# EAGLE board eTapper1main53 (EAGLE 8.5.2)
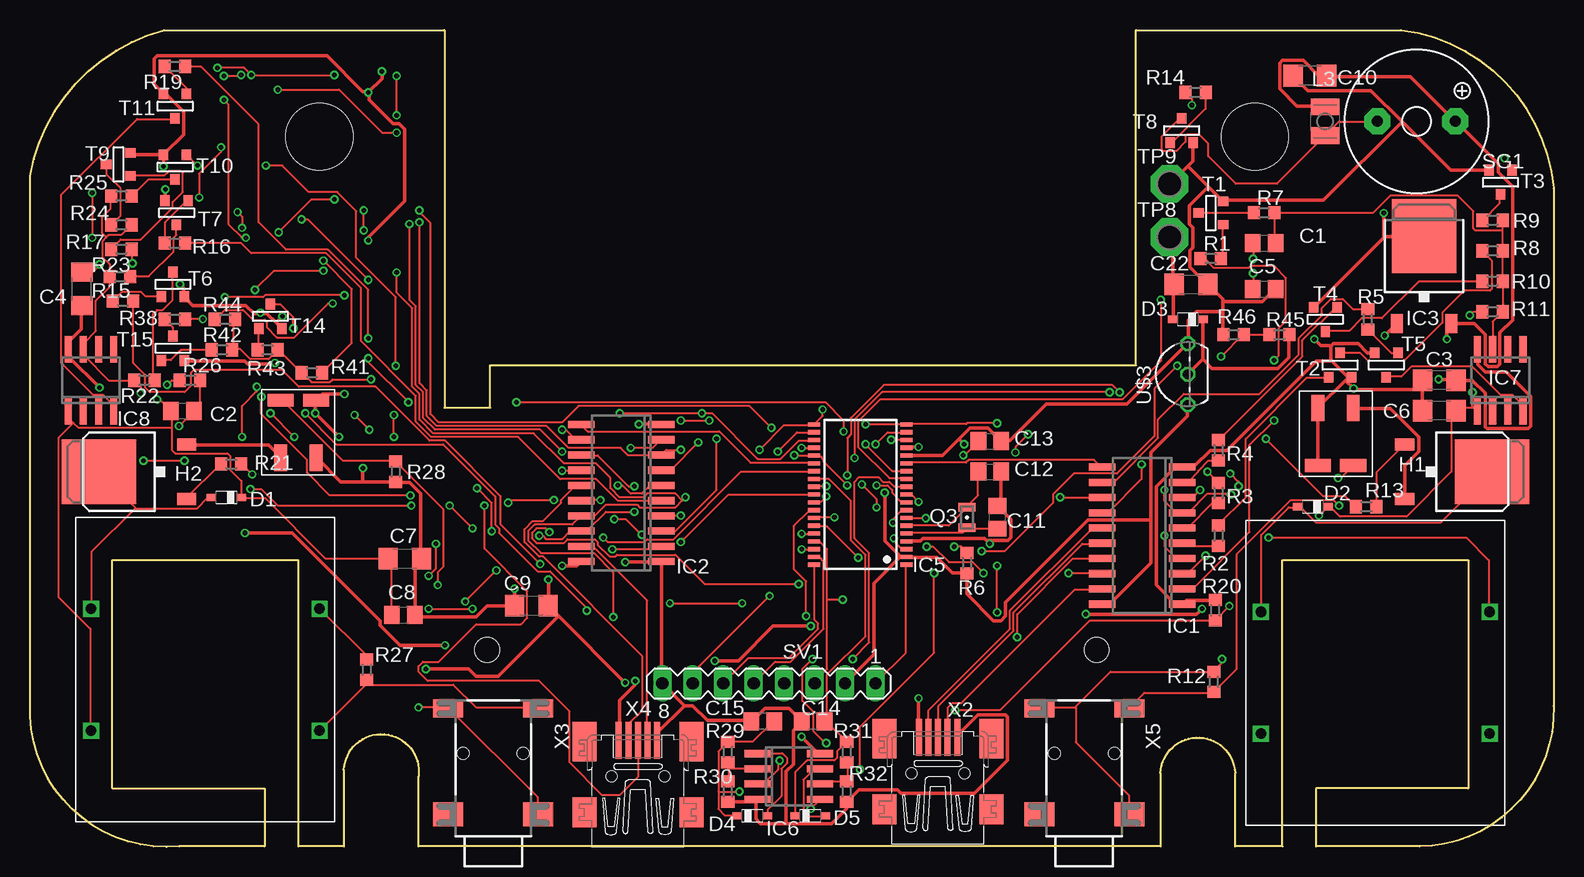
[diagram p1: board, top side]
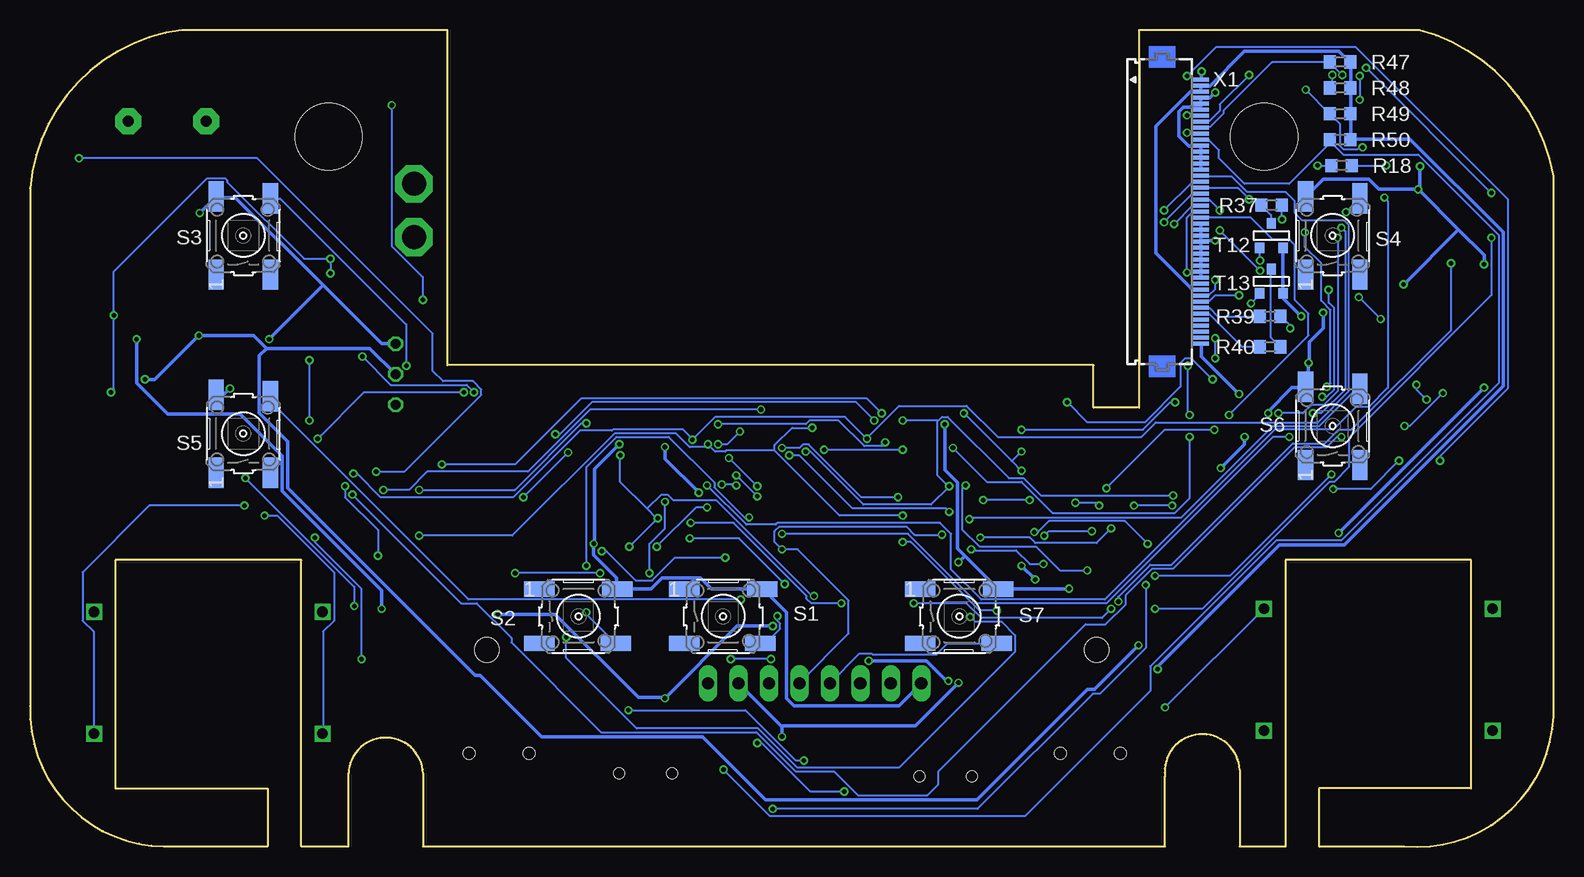
[diagram p2: board, bottom side, seen from below]

Size 127 x 68.12 mm. Coordinates in mm from the lower left corner, seen from the top.
Outline: 104.4,23.93 119.89,23.93 119.89,4.88 107.19,4.88 107.19,0.05 115.83,0.05 arc91 127,11.73 127,54.91 arc78 114.3,68.12 92.21,68.12 92.21,40.18 38.36,40.18 38.36,36.63 34.55,36.63 34.55,68.12 11.18,68.12 arc65 0,55.93 0,11.99 arc98 12.45,0.05 19.56,0.05 19.56,4.88 6.86,4.88 6.86,23.93 22.36,23.93 22.36,0.05 26.17,0.05 26.17,6.4 arc-185 32.39,5.89 32.39,0.05 94.24,0.05 94.24,6.15 arc-175 100.46,6.15 100.46,0.05 104.4,0.05 104.4,23.93
Copper layers (1*16): Top 0.035mm / dielectric 30mil / Bottom 0.035mm
Design rules "default *": minimum track width 6mil, minimum drill 15mil, track to track 6mil, track to pad 6mil, pad to pad 6mil, via to via 6mil, smd to smd 6mil, copper to edge 40mil, drill to drill 6mil, minimum pad ring 6mil, minimum via ring 6mil, stop-mask expansion 4mil, vias tented up to drill 0mil, thermal gap 10mil
Net classes: 1 GND: width 0.305 mm, clearance 0.152 mm; 2 BAT+: width 0.305 mm, clearance 0.152 mm; 3 +9V: width 0.305 mm, clearance 0.152 mm; 4 +3V: width 0.305 mm, clearance 0.152 mm; 5 VCC: width 0.305 mm, clearance 0.152 mm
Holes 5.59 mm at 24.13,59.23 102.11,59.23
Holes 2.03 mm at 38.1,16.43 88.9,16.43

## Footprints (pad centres in the part's own frame; a part is rotated, then mirrored left to right if it is on the bottom)
C0805 = smd 1.3 x 1.5: 1 -0.95,0; 2 0.95,0
C1206 = smd 1.6 x 1.8: 1 -1.4,0; 2 1.4,0
SOD323_ST = smd 0.8 x 0.6: A 1.25,0; C -1.25,0
XFMR = drill 0.889 square: P$1 -10.16,5.08; P$2 -10.16,-5.08; P$3 8.89,5.08; P$4 8.89,-5.08
D-PAK_TO252AA = smd 1 x 1.6: 1 -2.28,-4.8; 3 2.28,-4.8 | smd 5.4 x 6.2: 4 0,2.5
SO20 = smd 0.6 x 2.2: 1 -5.715,-3.33; 2 -4.445,-3.33; 3 -3.175,-3.33; 4 -1.905,-3.33; 5 -0.635,-3.33; 6 0.635,-3.33; 7 1.905,-3.33; 8 3.175,-3.33; 9 4.445,-3.33; 10 5.715,-3.33; 11 5.715,3.33; 12 4.445,3.33; 13 3.175,3.33; 14 1.905,3.33; 15 0.635,3.33; 16 -0.635,3.33; 17 -1.905,3.33; 18 -3.175,3.33; 19 -4.445,3.33; 20 -5.715,3.33
TO252 = smd 1 x 1.6: 1 -2.28,-4.8; 3 2.28,-4.8 | smd 5.4 x 6.2: 2 0,2.5
TSSOP38_R-PDSO-G38-DA = smd 0.35 x 1: 1 -5.85,-3.85; 2 -5.2,-3.85; 3 -4.55,-3.85; 4 -3.9,-3.85; 5 -3.25,-3.85; 6 -2.6,-3.85; 7 -1.95,-3.85; 8 -1.3,-3.85; 9 -0.65,-3.85; 10 0,-3.85; 11 0.65,-3.85; 12 1.3,-3.85; 13 1.95,-3.85; 14 2.6,-3.85; 15 3.25,-3.85; 16 3.9,-3.85; 17 4.55,-3.85; 18 5.2,-3.85; 19 5.85,-3.85; 20 5.85,3.85; 21 5.2,3.85; 22 4.55,3.85; 23 3.9,3.85; 24 3.25,3.85; 25 2.6,3.85; 26 1.95,3.85; 27 1.3,3.85; 28 0.65,3.85; 29 0,3.85; 30 -0.65,3.85; 31 -1.3,3.85; 32 -1.95,3.85; 33 -2.6,3.85; 34 -3.25,3.85; 35 -3.9,3.85; 36 -4.55,3.85; 37 -5.2,3.85; 38 -5.85,3.85
SO8 = smd 0.6 x 2.2: 1 -1.905,-2.6; 2 -0.635,-2.6; 3 0.635,-2.6; 4 1.905,-2.6; 5 1.905,2.6; 6 0.635,2.6; 7 -0.635,2.6; 8 -1.905,2.6
SO08 = smd 0.6 x 2.2: 1 -1.905,-2.6; 2 -0.635,-2.6; 3 0.635,-2.6; 4 1.905,-2.6; 5 1.905,2.6; 6 0.635,2.6; 7 -0.635,2.6; 8 -1.905,2.6
L2825P = smd 1.4 x 2.4: 1 -1.2,0; 2 1.2,0
FC-12M = smd 0.7 x 1.4: 1 -0.85,0; 2 0.85,0
R0603 = smd 1 x 1.1: 1 -0.85,0; 2 0.85,0
B3F-10XX = smd 2.54 x 1.27: 1 -3.251,2.261; 2 3.251,2.261; 3 -3.251,-2.261; 4 3.099,-2.261
F/QMBIII = drill 0.914 pad 2.159 octagon: + 3.251,0; - -3.251,0
MA08-1 = drill 1.016 long: 1 -8.89,0; 2 -6.35,0; 3 -3.81,0; 4 -1.27,0; 5 1.27,0; 6 3.81,0; 7 6.35,0; 8 8.89,0
SOT-23 = smd 0.787 x 0.889: 1 0.025,-1.016; 2 -0.94,1.016; 3 0.991,1.016
P1-20 = drill 2.007 pad 3.15 octagon: TP 0,0
CT02-250 = smd 1.067 x 2.184: P$1 -1.45,-2.4; P$2 1.5,-2.4 | smd 2.184 x 1.067: P$3 1.5,2.4; P$4 -1.45,2.4
TO92- = drill 0.813 octagon: 1 -1.27,1.27; 2 1.27,1.27; 3 3.81,1.27
FH12-45S-0.5SH = smd 0.3 x 1.3: 1 -13,3.25; 2 -12.5,3.25; 3 -12,3.25; 4 -11.5,3.25; 5 -11,3.25; 6 -10.5,3.25; 7 -10,3.25; 8 -9.5,3.25; 9 -9,3.25; 10 -8.5,3.25; 11 -8,3.25; 12 -7.5,3.25; 13 -7,3.25; 14 -6.5,3.25; 15 -6,3.25; 16 -5.5,3.25; 17 -5,3.25; 18 -4.5,3.25; 19 -4,3.25; 20 -3.5,3.25; 21 -3,3.25; 22 -2.5,3.25; 23 -2,3.25; 24 -1.5,3.25; 25 -1,3.25; 26 -0.5,3.25; 27 0,3.25; 28 0.5,3.25; 29 1,3.25; 30 1.5,3.25; 31 2,3.25; 32 2.5,3.25; 33 3,3.25; 34 3.5,3.25; 35 4,3.25; 36 4.5,3.25; 37 5,3.25; 38 5.5,3.25; 39 6,3.25; 40 6.5,3.25; 41 7,3.25; 42 7.5,3.25; 43 8,3.25; 44 8.5,3.25; 45 9,3.25
32005-201 = smd 3.1 x 0.5: 1 3,1.6; 2 3,0.8; 3 3,0; 4 3,-0.8; 5 3,-1.6 | smd 2.5 x 2: M1 -3,-4.45; M2 -3,4.45 | smd 3.3 x 2: M3 2.9,4.45; M4 2.9,-4.45 | hole 0.9: 0,2.2; 0,-2.2
1503_02 = smd 2.5 x 1.5: 1 -3.75,-10.75; 3 3.75,-10.75 | smd 2.5 x 2: 2 -3.75,-1.9; 2@2 3.75,-1.9 | hole 1: -2.5,-7; 2.5,-7

## Placement (x,y rotation side)
C1  .01uF  [C0805]  102.87,50.34 0 top
C2  .01uF  [C0805]  12.7,36.37 0 top
C3  [C1206]  117.48,38.91 180 top
C4  [C1206]  4.32,46.53 90 top
C5  3.3uF  [C0805]  102.87,46.53 0 top
C6  220uF  [C1206]  117.48,36.37 180 top
C7  220uF  [C1206]  31.25,24.05 0 top
C8  3.3uF  [C0805]  31.12,19.35 0 top
C9  47uF  [C1206]  41.79,20.12 180 top
C10  47uF  [C1206]  106.68,64.31 180 top
C11  12pF  [C0805]  80.65,27.48 90 top
C12  12pF  [C0805]  80.01,31.29 0 top
C13  1 uF  [C0805]  80.01,33.83 0 top
C14  0.1uF  [C0805]  65.28,10.46 180 top
C15  0.1uF  [C0805]  61.09,10.46 180 top
C22  220uF  [C1206]  96.78,46.91 0 top
D1  BAT60J  [SOD323_ST]  16.39,29.13 180 top
D2  BAT60J  [SOD323_ST]  106.94,28.37 180 top
D3  BAT60J  [SOD323_ST]  96.52,43.99 180 top
D4  BAT60J  [SOD323_ST]  60.2,2.59 0 top
D5  BAT60J  [SOD323_ST]  65.03,2.59 0 top
DRILEGEND  [DRILEGEND]  -4.57,-8.42 0 top  (outside the outline)
F1  XFMR  [XFMR]  112.78,14.53 0 top
F2  XFMR  [XFMR]  15.24,14.78 0 top
H1  IRLR024N  [D-PAK_TO252AA]  119.38,31.29 270 top
H2  IRLR024N  [D-PAK_TO252AA]  8.26,31.29 90 top
IC1  74AC373  [SO20]  92.71,25.96 90 top
IC2  74AC373  [SO20]  49.28,29.51 90 top
IC3  LM2936DT-5.0  [TO252]  116.21,48.44 0 top
IC5  MSP430F2232IDA  [TSSOP38_R-PDSO-G38-DA]  69.22,29.39 90 top
IC6  AD8620R  [SO8]  63.25,5.89 270 top
IC7  LP2951M  [SO08]  122.56,38.91 0 top
IC8  LP2951M  [SO08]  5.08,38.91 0 top
L3  470uH  [L2825P]  107.95,60.5 270 top
Q3  FC-12M  [FC-12M]  78.11,27.48 90 top
R1  47K  [R0603]  98.43,49.07 0 top
R2  47K  [R0603]  99.06,25.96 90 top
R3  47K  [R0603]  99.06,29.51 90 top
R4  47K  [R0603]  99.06,33.07 90 top
R5  47K  [R0603]  111.51,43.99 270 top
R6  47K  [R0603]  78.11,23.67 270 top
R7  1K  [R0603]  102.87,52.88 0 top
R8  3K  [R0603]  121.92,49.71 0 top
R9  6K  [R0603]  121.92,52.25 0 top
R10  12K  [R0603]  121.92,47.17 0 top
R11  3K  [R0603]  121.92,44.63 0 top
R12  51K  [R0603]  98.68,13.77 270 top
R13  1K  [R0603]  111.38,28.37 0 top
R14  1K  [R0603]  97.16,62.91 0 top
R15  47K  [R0603]  7.75,45.52 180 top
R16  47K  [R0603]  12.07,50.34 180 top
R17  47K  [R0603]  7.62,49.83 180 top
R18  47K  [R0603]  17.66,56.82 0 bottom
R19  47K  [R0603]  12.07,65.07 180 top
R20  47K  [R0603]  98.81,19.73 90 top
R21  1K  [R0603]  16.77,31.93 180 top
R22  1K  [R0603]  9.53,38.91 180 top
R23  3K  [R0603]  7.5,47.55 180 top
R24  6K  [R0603]  7.62,51.87 0 top
R25  12K  [R0603]  7.62,54.28 180 top
R26  3K  [R0603]  13.34,38.91 0 top
R27  51K  [R0603]  28.07,14.78 270 top
R28  47K  [R0603]  30.48,31.29 270 top
R29  50K  [R0603]  58.17,7.92 90 top
R30  1K  [R0603]  58.17,4.62 90 top
R31  50K  [R0603]  68.08,7.92 90 top
R32  1K  [R0603]  68.08,4.62 90 top
R37  100  [R0603]  23.5,53.52 0 bottom
R38  100  [R0603]  12.07,43.99 0 top
R39  100  [R0603]  23.63,44.25 180 bottom
R40  100  [R0603]  23.63,41.71 180 bottom
R41  47K  [R0603]  23.5,39.55 0 top
R42  47K  [R0603]  16.01,41.45 180 top
R43  47K  [R0603]  19.82,41.45 180 top
R44  47K  [R0603]  16.26,43.99 180 top
R45  47K  [R0603]  104.14,42.72 0 top
R46  10K  [R0603]  100.33,42.72 0 top
R47  47K  [R0603]  17.78,65.45 0 bottom
R48  47K  [R0603]  17.78,63.3 0 bottom
R49  47K  [R0603]  17.78,61.14 0 bottom
R50  47K  [R0603]  17.78,58.98 0 bottom
S1  [B3F-10XX]  69.22,19.23 0 bottom
S2  [B3F-10XX]  81.28,19.23 0 bottom
S3  [B3F-10XX]  109.22,50.98 90 bottom
S4  [B3F-10XX]  18.42,50.98 90 bottom
S5  [B3F-10XX]  109.22,34.47 90 bottom
S6  [B3F-10XX]  18.42,35.1 90 bottom
S7  [B3F-10XX]  49.53,19.23 0 bottom
SG1  F/QMBIII  [F/QMBIII]  115.57,60.5 0 top
SV1  100mil  [MA08-1]  61.6,13.64 180 top
T1  2N3904  [SOT-23]  98.43,52.88 270 top
T2  2N3904  [SOT-23]  109.22,40.18 180 top
T3  2N3904  [SOT-23]  122.56,55.42 0 top
T4  2N3904  [SOT-23]  107.95,43.99 0 top
T5  2N3904  [SOT-23]  113.03,40.18 0 top
T6  2N3904  [SOT-23]  11.94,46.91 180 top
T7  2N3904  [SOT-23]  12.2,52.88 0 top
T8  2N3904  [SOT-23]  96.02,59.74 180 top
T9  2N3904  [SOT-23]  7.37,56.95 270 top
T10  2N3904  [SOT-23]  12.07,56.69 0 top
T11  2N3904  [SOT-23]  12.07,61.77 0 top
T12  2N3904  [SOT-23]  23.5,50.98 180 bottom
T13  2N3904  [SOT-23]  23.5,47.17 180 bottom
T14  2N3904  [SOT-23]  20.07,44.25 180 top
T15  2N3904  [SOT-23]  11.94,41.58 180 top
TP8  TPSPAD1-20  [P1-20]  95,50.85 0 top
TP9  TPSPAD1-20  [P1-20]  95,55.29 0 top
U$1  CT02-250  [CT02-250]  108.84,34.21 180 top
U$2  CT02-250  [CT02-250]  22.36,34.85 0 top
U$3  MCP1702  [TO92-]  95.25,40.69 270 top
X1  FH12-45S-0.5SH  [FH12-45S-0.5SH]  32.64,50.98 270 bottom
X2  MINI-USB-SCHIELD-32005-201  [32005-201]  75.7,6.15 90 top
X3  1503_02  [1503_02]  38.61,0.81 180 top
X4  MINI-USB-SCHIELD-32005-201  [32005-201]  50.68,5.89 90 top
X5  1503_02  [1503_02]  87.89,0.81 180 top

## Tracks (layer width: path | path; a pad name or v marks a point on that pad's centre or on a via)
+3V  (via drill 0.38)
  Top 0.305: IC1.20 90,20.24 93.43,23.67 93.43,27.25 | 93.43,27.25 93.43,32.89 96.47,35.94 96.47,36.85 U$3.3 | v74.07,33.35 73.08,33.35 IC5.16 | v71.25,29.54 71.25,25.5 72.55,24.2 | 72.55,24.2 72.93,24.2 IC5.2 73.08,24.13 75.59,24.13 76.89,22.83 78.11,22.83 R6.2 78.11,21.08 80.32,18.87 80.93,18.87 81.31,19.25 81.31,20.39 88.17,27.25 93.43,27.25 | v43.21,22.3 43.21,20.17 C9.1 43.29,20.01 44.05,19.25 | v44.35,23.44 45.57,23.44 45.88,23.75 IC2.20 | v64.32,9.19 65.69,7.82 65.84,7.82 IC6.8 | v49.61,13.69 44.05,19.25 | 72.55,24.2 70.34,22 70.34,16.05 67.97,13.69 SV1.2 | v33,14.83 36.58,14.83 37.19,14.22 39.02,14.22 44.05,19.25
  Bottom 0.305: 29.42,62.99 30.26,62.99 33.15,60.1 33.15,49.5 30.1,46.46 29.42,46.46 X1.36 | 29.42,62.99 X1.3 | 29.42,62.99 29.42,63.45 X1.2 29.27,63.45 28.66,63.45 25.76,66.34 17.91,66.34 17.07,65.51 R47.2 16.92,65.43 16.92,63.37 R48.2 16.92,63.3 16.92,61.24 R49.2 16.92,61.09 16.92,59.03 R50.2 16.77,59.03 11.97,59.03 4.2,51.26 4.2,38.45 17.45,25.2 22.86,25.2 33,15.06 v33,14.83 | v74.07,33.35 74.07,32.36 v71.25,29.54 | v44.35,23.44 v43.21,22.3 | 64.32,10.03 v64.32,9.19 | 64.32,10.03 67.9,13.61 SV1.2 | v49.61,13.69 53.19,10.11 64.24,10.11 64.32,10.03
+9V  (via drill 0.38)
  Top 0.305: IC7.8 120.71,41.5 120.71,40.21 121.31,39.6 123.07,39.6 125.12,37.54 125.12,35.1 124.9,34.87 121.47,34.87 121.31,35.03 121.31,37.84 120.25,38.91 C3.1 118.8,38.99 v117.43,38.99 | C4.1 4.27,45.08 4.27,43.18 3.2,42.11 3.2,41.58 IC8.8 3.28,41.43 3.28,40.82 v5.8,38.3 | 97.77,40.66 97.77,43.94 D3.C | U$3.2 97.77,40.66 | 97.77,40.66 98.53,39.9 104.02,39.9 104.93,40.82 104.93,42.72 R45.2 | v112.93,42.65 IC3.1 | v17.91,26.19 21.87,26.19 29.19,18.87 29.19,18.49 30.87,16.81 v34.6,16.81
  Bottom 0.305: 107.29,41.58 108.36,42.65 v112.93,42.65 116.59,38.99 v117.43,38.99 | 107.29,41.58 98.68,41.58 U$3.2 | v17.91,26.19 v5.8,38.3 | v34.6,16.81 38.26,13.16 38.87,13.16 48.09,3.94 65.69,3.94 70.95,9.19 84.36,9.19 89.46,14.3 89.92,14.3 105.54,29.92 105.54,33.81 107.9,36.17 107.9,40.97 107.29,41.58
/LCS  (via drill 0.38)
  Top 0.152: v71.94,27.02 71.94,27.33 72.62,28.01 73,28.01 IC5.8 | v53.34,20.32 v59.36,20.32 | v33.23,19.86 v36.89,19.86 | v5.19,54.53 v5.19,50.8 | v15.63,64.97 17.84,64.97 v18.44,64.36 v25.38,64.36
  Bottom 0.152: v71.94,27.02 68.36,27.02 62.26,20.93 62.26,20.7 61.88,20.32 v59.36,20.32 | v53.34,20.32 48.92,20.32 47.71,19.1 37.65,19.1 v36.89,19.86 | v33.23,19.86 29.27,19.86 18.67,30.45 18.29,30.45 17.07,31.67 17.07,34.11 5.19,46 v5.19,50.8 | v15.63,64.97 v5.19,54.53 | v18.44,64.36 18.44,63.45 18.6,63.3 R48.1 | v25.38,64.36 27.82,61.92 27.82,61.39 28.66,60.55 29.34,60.55 X1.8
/RST  (via drill 0.38)
  Top 0.152: v74.68,27.41 73.08,27.41 IC5.7 | v77.04,25.04 77.65,25.04 78.11,24.59 R6.1 | v77.8,32.66 77.88,32.66 79.02,33.81 C13.1 | SV1.7 55.25,14.53 v61.65,20.93
  Bottom 0.152: v77.04,25.04 v74.68,27.41 74.76,27.41 75.56,28.21 | v77.8,32.66 77.8,30.45 75.56,28.21 | v61.65,20.93 61.8,20.93 69.8,28.93 73.39,28.93 73.84,29.39 74.38,29.39 75.56,28.21
BAT+
  Top 0.305: D3.A 95.33,44.02 95.33,46.91 C22.1 95.25,46.99 95.25,50.57 95.03,50.8 TP8.TP
GND  (via drill 0.38)
  Top 0.305: R20.2 98.76,20.55 96.4,20.55 96.09,20.24 IC1.1 95.94,20.32 95.41,20.32 93.88,21.84 93.88,30.07 95.48,31.67 IC1.10 96.17,31.75 97.08,31.75 98.38,33.04 99.75,33.04 107.22,40.51 108.36,40.51 108.44,40.59 | C6.2 116.06,36.4 116.06,38.91 C3.2 115.98,38.15 110.42,38.15 v110.34,38.23 109.66,38.91 | 109.66,38.91 107.37,36.63 U$1.P$2 107.37,36.47 107.37,31.82 U$1.P$3 | 109.66,38.91 109.88,39.14 110.11,39.14 T2.2 109.81,39.22 108.44,40.59 | T5.2 111.49,41.2 110.72,41.96 108.67,41.96 108.44,41.73 | 108.44,40.59 108.44,41.73 | T3.2 118.42,56.44 114.38,60.48 | 114.38,60.48 111.79,63.07 106.53,63.07 105.31,64.29 C10.2 | 112.93,50.87 107.07,45.01 T4.2 | 112.93,50.87 116.21,50.87 IC3.2 | v112.86,52.86 112.86,50.95 112.93,50.87 | 96.51,56.78 95.03,55.29 TP9.TP | 96.51,56.78 96.93,57.2 96.93,58.72 T8.2 | 96.51,56.78 98.23,55.07 | 98.23,55.07 99.45,53.85 T1.2 99.52,53.92 107.83,53.92 114.38,60.48 | 77.42,34.03 78.34,34.95 79.86,34.95 80.93,33.88 C13.2 81.08,33.88 81.69,33.88 84.74,36.93 91.44,36.93 96.4,41.88 U$3.1 96.55,41.96 96.55,43.94 97.24,44.63 99.45,44.63 | 77.42,34.03 76.05,32.66 73.08,32.66 IC5.15 | 99.45,45.46 99.45,45.69 98.23,46.91 C22.2 98.07,46.99 96.7,48.36 96.7,49.73 96.93,49.96 96.93,51.64 96.63,51.94 96.63,53.47 98.23,55.07 | 99.45,45.46 99.45,44.63 | 99.45,44.63 99.45,42.72 R46.1 | 99.45,45.46 102.72,45.46 103.79,46.53 C5.2 | v107.07,42.34 107.6,41.81 108.36,41.81 108.44,41.73 | v26.22,37.77 24.39,37.77 23.93,37.31 U$2.P$3 23.78,37.16 v23.78,36.17 v25.76,34.19 | v20.43,40.36 20.35,40.28 18.14,40.28 17.91,40.51 12.88,40.51 T15.2 | 20.5,43.71 19.74,44.47 19.21,44.47
  Top 0.305: 20.5,43.71 20.96,43.25 T14.2 | 19.21,44.47 18.67,44.47 17.99,45.16 13.57,45.16 12.88,45.85 T6.2 12.81,46 12.81,46.61 v12.5,46.91 | 20.5,43.71 v21.04,44.25 | v19.21,44.55 19.21,44.47 | v29.34,64.67 29.34,64.06 v28.2,62.91 | v28.2,50.57 28.2,50.8 31.25,53.85 31.25,59.87 30.79,60.32 30.26,60.32 28.27,62.3 28.27,62.84 v28.2,62.91 | T9.2 8.54,57.73 11.13,57.73 T10.2 | T10.2 11.21,57.81 12.81,59.41 12.81,61.31 11.36,62.76 11.13,62.76 T11.2 11.05,62.91 10.37,63.6 10.37,65.73 10.6,65.96 24.77,65.96 27.74,62.99 28.12,62.99 v28.2,62.91 | v11.28,54.84 11.28,53.92 T7.2 | v5.8,48.59 5.19,47.98 4.35,47.98 C4.2 | v11.13,56.74 T10.2 | 27.74,30.45 25.91,30.45 23.93,32.43 U$2.P$2 | 27.74,30.45 30.48,30.45 R28.2 30.56,30.38 31.63,30.38 32.54,29.46 32.54,24.13 C7.2 32.62,24.05 32.08,23.52 32.08,19.4 C8.2 32.16,19.25 32.24,19.18 37.19,19.18 38.1,20.09 40.31,20.09 C9.2 40.39,20.24 v40.39,21.54 | R30.1 58.22,3.78 60.43,3.78 60.58,3.94 IC6.4 60.51,3.71 60.51,2.34 60.89,1.95 63.02,1.95 | 63.02,1.95 66.83,1.95 68.05,3.17 68.05,3.71 R32.1 68.2,3.86 69.12,4.77 72.32,4.77 72.62,4.47 78.72,4.47 81.46,7.21 81.46,10.87 81.31,11.02 79.02,11.02 77.35,9.35 77.35,9.19 X2.5 | 80.01,25.58 81.54,25.58 81.77,25.81 81.77,27.33 80.7,28.4 C11.2 80.7,28.55 80.93,28.78 80.93,31.29 C12.2 | 80.01,25.58 79.71,25.58 79.56,25.73 74.45,25.73 74.22,25.5 73.08,25.5 IC5.4 | v80.01,25.27 80.01,25.58 | v50.75,35.25 52.58,35.25 IC2.10 | 54.56,11.78 55.25,11.78 56.47,10.57 60.05,10.57 C15.2 60.2,10.49 61.27,11.56 63.25,11.56 64.32,10.49 C14.2 64.24,10.34 63.63,9.73 63.63,6.91 63.02,6.3 63.02,1.95
  Top 0.305: 54.56,11.78 SV1.8 52.66,13.69 52.66,23.75 IC2.1 52.51,23.75 v49.61,23.75 | 54.56,11.78 52.28,9.5 52.28,8.96 X4.5 | 27.74,30.45 v27.74,31.6 | v77.88,33.58 77.42,34.03
  Bottom 0.305: v110.34,38.23 110.8,37.77 111.49,37.77 S5.2 | v112.86,52.86 S3.2 111.41,54.15 109.88,54.15 102.57,46.84 | 102.57,46.84 97.69,41.96 U$3.1 | 102.57,46.84 v107.07,42.34 | v26.22,37.77 29.34,40.89 29.34,41.96 X1.45 | T12.2 T13.2 22.48,46.07 22.48,45.69 v21.04,44.25 | v19.21,44.55 19.21,43.25 20.35,42.11 20.35,40.44 v20.43,40.36 20.43,38.61 S6.2 20.81,38.3 21.8,38.3 23.78,36.32 v23.78,36.17 | X1.34 29.42,47.52 29.42,47.9 X1.33 29.42,48.13 29.42,48.44 X1.32 29.42,48.59 29.42,48.97 X1.31 29.42,49.12 29.42,49.43 X1.30 29.42,49.58 29.42,49.96 X1.29 29.42,50.11 29.42,50.42 X1.28 | X1.28 29.42,50.57 29.42,50.95 X1.27 29.42,51.1 29.42,51.41 X1.26 29.42,51.56 29.42,51.94 X1.25 | X1.16 29.42,56.51 29.42,56.97 X1.15 29.42,57.12 29.42,57.43 X1.14 29.42,57.58 29.42,57.96 X1.13 29.42,58.11 29.42,58.42 X1.12 29.57,58.42 30.41,58.42 31.25,59.26 31.25,61.31 30.87,61.7 29.42,61.7 | 29.42,61.7 29.42,61.92 X1.5 29.42,62.08 29.42,62.46 X1.4 29.27,62.46 28.66,62.46 v28.2,62.91 | 29.42,61.7 29.42,61.54 X1.6 | v29.34,64.67 29.34,63.98 X1.1 | v28.2,50.57 29.27,50.57 X1.28 | v11.28,54.84 14.56,54.84 15.4,55.68 19.21,55.68 20.65,54.23 S4.2 | v5.8,48.59 5.8,49.35 7.93,51.48 | v11.28,54.84 7.93,51.48 | v11.13,56.74 11.13,54.84 v11.28,54.84 | 7.93,51.48 v12.5,46.91 | v50.75,35.25 50.75,31.44 49.69,30.38 49.69,24.89 49.08,24.28 | 49.08,24.28 S7.2 46.18,21.54 v40.39,21.54 | v49.61,23.75 49.08,24.28 | SV1.8 54.56,11.78 63.33,11.78 63.94,12.39 63.94,19.56 65.84,21.46 S1.2 65.99,21.54 70.18,21.54 71.1,22.45 74.3,22.45 75.21,21.54 78.03,21.54 S2.2 78.11,21.61 78.11,22.45 80.01,24.36 v80.01,25.27 79.94,25.35 79.94,31.52 v77.88,33.58
  Bottom 0.305: v25.76,34.19 25.76,33.58 v27.74,31.6
IO1_0  (via drill 0.38)
  Top 0.152: v64.7,19.25 64.7,22.15 63.71,23.14 63.71,26.8 64.93,28.01 65.31,28.01 IC5.31
  Bottom 0.152: v64.7,19.25 64.7,18.87 64.47,18.64 64.47,18.19 65.69,16.97 S1.4
IO1_1  (via drill 0.38)
  Top 0.152: v67.06,27.48 65.38,27.48 IC5.32 | v80.62,19.56 v80.62,23.44
  Bottom 0.152: v67.06,27.48 67.44,27.48 69.96,30 69.96,30.38 73.77,34.19 78.11,34.19 80.62,31.67 v80.62,23.44 | v80.62,19.56 80.62,19.4 S2.4
IO1_2  (via drill 0.38)
  Top 0.152: v69.04,24.13 66.45,26.72 65.38,26.72 IC5.33 | v79.33,24.66 81.23,24.66 85.27,28.7 85.27,29.39 87.02,31.14 90.61,31.14 93.73,34.26 93.73,38.23 v95.64,40.13
  Bottom 0.152: v69.04,24.13 73.23,24.13 75.14,22.22 76.51,22.22 78.95,24.66 v79.33,24.66 | v95.64,40.13 95.64,43.56 106.15,54.08 S3.4
IO1_3  (via drill 0.38)
  Top 0.152: v64.32,26.11 65.31,26.11 IC5.34 | v20.05,36.17 v22.03,34.19 | v17.68,51.64 17.68,52.55 v17.3,52.93
  Bottom 0.152: v64.32,26.11 53.8,26.11 48.01,20.32 37.27,20.32 23.4,34.19 v22.03,34.19 | v20.05,36.17 19.36,36.17 17.38,38.15 17.38,51.33 v17.68,51.64 | S4.4 v17.3,52.93
IO4_0  (via drill 0.38)
  Top 0.152: v71.78,33.96 73,33.96 IC5.17 | v57.23,34.03 57.23,29.77 53.8,26.34 IC2.3 | v98,24.28 96.55,22.83 96.09,22.83 IC1.3 | v100.74,30.07 100.74,30.45 v100.06,31.14
  Bottom 0.152: X1.17 29.34,55.9 26.83,55.9 25.53,54.61 22.33,54.61 21.57,53.85 21.57,52.86 20.96,52.25 17.45,52.25 17.07,51.87 17.07,38 19.66,35.41 33.15,35.41 34.37,34.19 46.33,34.19 48.92,36.78 54.56,36.78 57.23,34.11 v57.23,34.03 59.06,35.86 69.88,35.86 v71.78,33.96 71.78,34.03 72.55,34.8 78.41,34.8 78.49,34.72 81.16,34.72 86.72,29.16 97.77,29.16 99.75,31.14 v100.06,31.14 | v98,24.28 98,26.41 100.74,29.16 v100.74,30.07
IO4_1  (via drill 0.38)
  Top 0.152: v70.49,33.58 71.48,34.57 73,34.57 IC5.18 | v54.26,27.63 52.66,27.63 IC2.4 | v32.47,53.08 32.47,52.93 33.38,52.02 33.38,36.09 34.07,35.41 44.35,35.41 45.72,36.78 59.97,36.78 v61.8,34.95 | IC1.4 95.56,24.05 94.57,25.04 v94.57,25.96
  Bottom 0.152: 64.93,33.04 68.97,33.04 69.04,32.97 69.88,32.97 v70.49,33.58 70.49,33.5 70.64,33.35 72.01,33.35 73.16,34.49 78.26,34.49 86.8,25.96 v94.57,25.96 | 64.93,33.04 59.52,27.63 v54.26,27.63 | v32.47,53.08 30.1,55.45 29.42,55.45 X1.18 | v61.8,34.95 63.48,34.95 64.93,33.5 64.93,33.04
IO4_2  (via drill 0.38)
  Top 0.152: v69.65,35.25 73,35.25 IC5.19 73.08,35.25 78.03,35.25 78.11,35.33 v80.62,35.33 | v55.71,33.73 53.42,31.44 52.66,31.44 IC2.7 | v25.38,54 23.47,54 v20.73,51.26 | v18.9,38.38 18.9,38 17.68,36.78 v17.68,34.19 | v100.13,29.39 99.75,29.39 99.67,29.46 98.15,29.46 96.55,27.86 IC1.7 95.56,27.86 94.57,28.85 v94.57,29.77
  Bottom 0.152: v69.65,35.25 62.34,35.25 62.03,35.56 59.59,35.56 57.46,33.43 56.01,33.43 v55.71,33.73 | v25.38,54 26.29,54.91 29.34,54.91 X1.19 | v20.73,51.26 20.73,50.04 19.36,48.67 19.36,45.54 18.6,44.78 18.6,38.68 v18.9,38.38 | v17.68,34.19 18.06,34.19 18.9,33.35 21.57,33.35 31.7,23.21 33.46,23.21 35.67,21 35.67,20.24 37.34,18.57 39.02,18.57 51.29,6.3 51.29,5.23 52.2,4.32 57.99,4.32 59.97,6.3 63.17,6.3 66.45,9.57 79.4,9.57 86.87,17.04 86.87,17.42 89.77,20.32 91.06,20.32 v100.13,29.39 | v80.62,35.33 81.01,35.33 86.57,29.77 v94.57,29.77
IO4_3  (via drill 0.38)
  Top 0.152: v60.81,33.12 62.87,35.18 65.31,35.18 IC5.20 65.38,35.25 66.07,35.94 v66.07,36.47 | v54.26,33.12 53.04,33.12 52.66,32.74 IC2.8 52.58,32.66 49.84,32.66 49.23,33.27 44.89,33.27 43.06,35.1 33.91,35.1 33.08,35.94 33.08,38.07 32.47,38.68 v32.47,52.09 | v97.54,29.77 96.93,29.16 96.09,29.16 IC1.8
  Bottom 0.152: v54.26,33.12 v60.81,33.12 | v32.47,52.09 30.1,54.46 29.42,54.46 X1.20 | v97.54,29.77 95.41,29.77 93.88,31.29 85.5,31.29 80.32,36.47 v66.07,36.47
IO4_4  (via drill 0.38)
  Top 0.152: v62.34,32.97 63.94,34.57 65.31,34.57 IC5.21 | v50.37,30.07 49.92,30.07 47.32,32.66 45.95,32.66 IC2.13 | v27.82,51.41 v27.82,53.08 | v24.46,48.06 20.35,48.06 v18.75,46.46 | v19.28,37.54 19.28,36.09 23.09,32.28 23.09,31.22 25,29.31 v31.7,29.31 | v85.88,29.16 89.31,29.16 IC1.13 | v82.15,32.89 82.15,33.35 v83.21,34.42 | v54.26,35.56 v56.62,35.56
  Bottom 0.152: v62.34,32.97 61.96,32.97 57.54,28.55 51.9,28.55 v50.37,30.07 50.45,30.07 51.36,30.99 51.36,35.48 51.33,35.52 | v27.82,53.08 28.66,53.92 29.34,53.92 X1.21 | v24.46,48.06 v27.82,51.41 | v18.75,46.46 18.75,45.39 18.29,44.93 18.29,38.15 18.9,37.54 v19.28,37.54 | v31.7,29.31 42.75,29.31 44.2,30.76 45.42,30.76 50.53,35.86 50.98,35.86 51.33,35.52 | v82.15,32.89 v85.88,29.16 | v83.21,34.42 82.83,34.42 80.17,37.08 58.15,37.08 v56.62,35.56 | v54.26,35.56 51.36,35.56 51.33,35.52
IO4_5  (via drill 0.38)
  Top 0.152: v49.15,36.17 v56.01,36.17 56.85,36.17 60.66,32.36 62.56,32.36 64.09,33.88 65.31,33.88 IC5.22 | v44.35,31.37 45.88,31.37 IC2.14 | v31.63,51.94 31.63,45.62 32.16,45.08 32.16,38.53 32.77,37.92 32.77,35.79 33.76,34.8 42.52,34.8 v44.35,32.97 | IC1.14 89.84,27.86 92.66,30.68 v92.66,31.9
  Bottom 0.152: v44.35,31.37 45.15,32.17 | 45.15,32.17 v49.15,36.17 | v31.63,51.94 30.1,53.47 29.42,53.47 X1.22 | 45.15,32.17 v44.35,32.97 | v92.66,31.9 86.57,31.9 81.08,37.39 57.23,37.39 v56.01,36.17
IO4_6  (via drill 0.38)
  Top 0.152: v64.32,33.27 65.31,33.27 IC5.23 | 54.37,28.89 53.8,28.32 50.83,28.32 50.6,28.55 48.01,28.55 47.1,27.63 45.95,27.63 IC2.17 45.88,27.56 45.19,26.87 42.07,26.87 41.53,26.34 41.53,25.58 42.6,24.51 47.02,24.51 48.62,22.91 v48.62,19.18 | 54.37,28.89 v54.64,29.16 | v30.56,47.9 30.56,46.23 31.86,44.93 31.86,38.38 32.47,37.77 32.47,35.63 33.61,34.49 41.99,34.49 44.51,31.98 47.17,31.98 48.39,30.76 48.39,29.92 49.15,29.16 51.13,29.16 51.44,29.46 53.8,29.46 54.37,28.89 | IC1.17 86.95,24.05 82.3,19.4 v82.3,17.5
  Bottom 0.152: v64.32,33.27 62.87,33.27 62.56,33.58 62.11,33.58 57.69,29.16 v54.64,29.16 | v30.56,47.9 30.56,52.48 30.1,52.93 29.42,52.93 X1.23 | v82.3,17.5 82.3,15.75 76.43,9.88 66.3,9.88 63.02,6.6 54.56,6.6 44.89,16.28 44.89,17.65 46.03,18.79 48.24,18.79 v48.62,19.18
IO4_7  (via drill 0.38)
  Top 0.152: v63.71,32.66 65.31,32.66 IC5.24 65.38,32.59 65.84,32.59 66.15,32.28 66.15,32.13 v68.13,30.15 | v50.37,27.94 48.01,27.94 46.41,26.34 IC2.18 45.04,26.34 44.35,25.65 43.06,25.65 42.75,25.96 v42.45,25.96 | v28.27,34.8 v27.06,36.02 | v37.27,29.92 38.49,28.7 v38.49,26.34 | v86.57,22.83 89.31,22.83 IC1.18 | v79.48,22.83 78.57,23.75 76.59,23.75 75.29,25.04 v74.76,25.04 | v70.57,28.32 70.57,29.01 v69.35,30.22
  Bottom 0.152: v63.71,32.66 62.87,32.66 58.45,28.24 50.68,28.24 v50.37,27.94 | v27.06,36.02 20.43,42.65 20.43,44.47 21.57,45.62 21.57,50.19 22.03,50.65 23.4,50.65 25.23,52.48 29.34,52.48 X1.24 | v28.27,34.8 32.39,34.8 v37.27,29.92 | v38.49,26.34 42.07,26.34 v42.45,25.96 | v79.48,22.83 v86.57,22.83 | v74.76,25.04 71.48,28.32 v70.57,28.32 | v69.35,30.22 68.2,30.22 v68.13,30.15
LADC  (via drill 0.38)
  Top 0.152: 57.38,4.62 57.38,7.97 58.15,8.74 R29.2 58.22,8.81 60.28,8.81 61.88,10.41 62.03,10.41 C15.1 | 57.38,4.62 57.38,3.17 57.92,2.64 58.91,2.64 D4.C | v68.58,15.67 69.96,17.04 69.96,24.51 68.74,25.73 68.74,30.45 69.12,30.83 70.72,30.83 71.1,30.45 71.63,30.45 72.01,30.07 73,30.07 IC5.11 | v65.23,15.67 64.39,14.83 64.39,12.17 65.31,11.25 65.31,9.65 66.3,8.66 v66.37,8.66 | 57.38,4.62 v59.14,4.62
  Bottom 0.152: v65.23,15.67 v68.58,15.67 | v66.37,8.66 65.99,8.66 61.96,4.62 v59.14,4.62
LCLOCK
  Top 0.152: IC1.16 89.31,25.27 87.71,25.27 82,19.56 82,18.03 75.75,11.78 75.75,9.19 X2.3
LCLR
  Top 0.152: IC1.19 89.31,21.46 87.1,21.46 77.65,12.01 76.89,12.01 76.51,11.63 76.51,9.19 X2.4
LD_/C  (via drill 0.38)
  Top 0.152: IC5.29 58.22,29.39 v54.26,25.42 | v46.41,19.71 46.41,19.94 43.36,22.99 42.3,22.99 39.1,26.19 39.1,26.57 38.79,26.87 38.79,29.23 34.45,33.58 25.53,33.58 v22.94,36.17 | v17.99,50.8 17.68,50.8 16.54,51.94 16.54,61.92 v16.16,62.3 | v16.16,64.29 17.53,64.29 v17.61,64.36
  Bottom 0.152: v54.26,25.42 53.57,25.42 47.86,19.71 v46.41,19.71 | v22.94,36.17 20.88,36.17 20.2,36.85 19.13,36.85 17.99,38 v17.99,50.8 | v16.16,64.29 v16.16,62.3 | v17.61,64.36 18.67,65.43 R47.1 18.75,65.43 23.47,65.43 27.51,61.39 27.51,61.16 28.66,60.02 29.34,60.02 X1.9
LDIN
  Top 0.152: IC1.15 89.31,26.57 88.55,26.57 81.69,19.71 81.69,18.19 74.91,11.4 74.91,9.19 X2.2
LEDK1  (via drill 0.38)
  Top 0.152: v22.64,52.32 23.17,52.32 v28.2,47.29
  Bottom 0.152: v22.64,52.32 22.64,53.47 R37.2 | v28.2,47.29 28.2,46.53 28.73,46 29.34,46 X1.37
LEDK2  (via drill 0.38)
  Top 0.152: v14.41,44.02 12.96,44.02 R38.2 | v16.24,45.85 19.44,45.85 19.59,46 v26.22,46
  Bottom 0.152: v16.24,45.85 v14.41,44.02 | v26.22,46 28.2,46 28.66,45.54 29.34,45.54 X1.38
LEDK3
  Bottom 0.152: R39.2 27.97,44.25 28.66,44.93 29.34,44.93 X1.39
LEDK4
  Bottom 0.152: R40.2 24.54,41.73 25.99,41.73 28.73,44.47 29.34,44.47 X1.40
LHVTRIG  (via drill 0.38)
  Top 0.152: v66.37,29.23 65.92,28.78 65.38,28.78 IC5.30 | v68.13,30.99 68.13,34.11 68.43,34.42 68.43,35.79 71.18,38.53 90.23,38.53 v90.83,37.92 | v103.03,34.03 107.83,29.23 109.66,29.23 110.49,28.4 R13.1
  Bottom 0.152: v68.13,30.99 v66.37,29.23 | v90.83,37.92 99.14,37.92 v103.03,34.03
LLED  (via drill 0.38)
  Top 0.152: R44.1 17.07,43.94 16.92,43.79 16.92,41.5 R42.1 17,41.5 17.53,41.5 18.37,40.66 19.89,40.66 20.65,41.43 R43.1 20.73,41.43 22.64,39.52 R41.1 22.71,39.52 23.47,38.76 25,38.76 25.23,38.99 v28.43,38.99 | v69.65,33.58 71.86,31.37 73,31.37 IC5.13 | v67.82,34.64 67.82,35.56 66.3,37.08 v40.54,37.08
  Bottom 0.152: v69.65,33.58 68.89,33.58 v67.82,34.64 | v40.54,37.08 38.87,35.41 34.07,35.41 31.09,38.38 31.09,40.36 30.71,40.74 30.18,40.74 v28.43,38.99
LOPA  (via drill 0.38)
  Top 0.152: v99.98,20.09 98.84,18.95 R20.1 98.76,18.87 88.32,18.87 80.85,11.4 v77.12,11.4 | v109.05,30.76 109.28,30.76 110.27,31.75 U$1.P$4 | v62.49,7.21 62.34,7.06 62.34,6.45 61.19,5.31 60.66,5.31 IC6.3
  Bottom 0.152: v99.98,20.09 99.98,21.69 v109.05,30.76 | v62.49,7.21 63.17,7.21 67.37,11.4 v77.12,11.4
LRD  (via drill 0.38)
  Top 0.152: IC5.10 73.46,29.39 v74.07,28.78 | v75.37,22.83 75.37,16.2 69.19,10.03 v69.19,6.45
  Bottom 0.152: v74.07,28.78 74.07,26.57 75.37,25.27 v75.37,22.83 | v69.19,6.45 65.31,2.56 44.05,2.56 33.61,13 33.61,15.06 23.09,25.58 17.68,25.58 4.58,38.68 4.58,51.03 11.28,57.73 17.53,57.73 18.6,58.8 18.6,58.95 R50.1 18.6,58.72 22.03,55.29 25.76,55.29 27.89,57.43 27.89,58.11 28.73,58.95 29.34,58.95 X1.11
LRESET  (via drill 0.38)
  Top 0.152: v47.78,25.81 48.16,25.42 51.21,25.42 51.44,25.65 53.65,25.65 59.29,31.29 65.31,31.29 IC5.26 | v34.98,28.47 v36.89,26.57 | v31.78,28.47 20.65,28.47 19.28,29.84 v18.37,29.84 | v9.45,32.21 v12.88,32.21 | v30.56,61.01 v30.56,64.29
  Bottom 0.152: v47.78,25.81 43.67,25.81 43.21,25.35 38.1,25.35 v36.89,26.57 | v31.78,28.47 v34.98,28.47 | v18.37,29.84 15.24,29.84 v12.88,32.21 | v9.45,32.21 9.45,32.59 3.81,38.23 3.81,54 16.54,66.72 28.12,66.72 v30.56,64.29 | v30.56,61.01 29.42,61.01 X1.7
LTS+  (via drill 0.38)
  Top 0.152: X5.1 91.67,11.63 92.89,12.85 98.68,12.85 R12.2 100.59,14.83 100.59,24.43 105.08,28.93 108.67,28.93 v109.12,28.47
  Bottom 0.152: v109.12,28.47 117.05,28.47 122.61,22.91 122.61,18.87 121.7,17.96 121.7,9.5 F1.P$4
LTS-  (via drill 0.38)
  Top 0.152: 87.14,11.67 87.1,11.63 84.21,11.63 X5.3 | 87.14,11.67 90.07,14.6 98.68,14.6 R12.1 98.68,14.68 99.37,15.37 v99.37,15.67 | X5.2 91.6,2.72 91.6,4.32 87.18,8.74 87.18,11.63 87.14,11.67 | v103.26,25.81 119.71,25.81 121.62,23.9 121.62,19.63 F1.P$3
  Bottom 0.152: v103.26,25.81 103.26,25.42 99.37,21.54 v99.37,15.67
LVSEL
  Top 0.152: IC5.14 73.08,32.05 78.03,32.05 78.26,32.28 88.7,32.28 89.31,31.67 IC1.11
LWR  (via drill 0.38)
  Top 0.152: v70.57,30.15 71.48,30.15 71.86,29.77 71.86,29.54 72.62,28.78 73,28.78 IC5.9 | v14.1,54.15 14.1,56.13 15.93,57.96 v15.93,58.34 | v30.56,59.56 29.34,59.56 25.76,63.14 v20.65,63.14
  Bottom 0.152: v70.57,30.15 67.29,26.87 64.85,26.87 64.7,27.02 51.13,27.02 50.22,26.11 50.22,23.14 47.71,20.62 37.42,20.62 23.25,34.8 18.37,34.8 16.46,36.7 15.4,36.7 13.8,38.3 13.8,53.85 v14.1,54.15 | v15.93,58.34 16.16,58.34 16.31,58.19 17.53,58.19 17.84,58.49 17.84,60.32 18.6,61.09 R49.1 18.67,61.16 v20.65,63.14 | v30.56,59.56 30.48,59.49 29.42,59.49 X1.10
N$1  (via drill 0.38)
  Top 0.152: v103.71,40.59 104.09,40.97 104.09,43.25 104.7,43.86 104.7,47.45 103.71,48.44 101.73,48.44 101.58,48.28 98.68,48.28 97.92,49.05 97.62,49.05 R1.1 | v103.71,35.56 101.66,33.5 101.66,26.26 96.93,21.54 96.09,21.54 IC1.2
  Bottom 0.152: v103.71,35.56 v103.71,40.59
N$2
  Top 0.152: R2.1 96.25,25.12 96.09,25.27 IC1.5
N$3
  Top 0.152: R3.1 99.06,28.62 98.53,28.62 96.55,26.64 96.09,26.64 IC1.6
N$4
  Top 0.152: R4.1 99.06,32.21 98.23,32.21 97.39,31.37 97.39,31.29 96.55,30.45 96.09,30.45 IC1.9
N$5
  Top 0.152: R5.1 111.49,44.86 110.27,44.86 109.43,45.69 108.44,45.69 107.68,44.93 107.68,44.32 105.77,42.42 105.77,41.05 102.49,37.77 96.17,37.77 94.04,35.63 94.04,34.11 90.38,30.45 89.39,30.45 IC1.12
N$6
  Top 0.152: T8.1 95.94,60.7 95.79,60.7 94.34,59.26 94.34,58.19 94.49,58.04 95.56,58.04 96.32,58.8 96.32,59.26 96.47,59.41 97.46,59.41 98.23,58.65 98.23,57.58 100.51,55.29 103.94,55.29 107.9,59.26 L3.2 107.98,59.33 109.12,60.48 112.32,60.48 SG1.-
N$7
  Top 0.152: T4.3 108.89,45.01 107.6,43.71 107.52,43.71 106.07,42.26 106.07,40.89 99.06,33.88 R4.2
N$8
  Top 0.152: T5.3 113.47,41.2 111.56,43.1 R5.2
N$9
  Top 0.152: F1.P$1 102.65,19.63 102.65,26.03 104.93,28.32 105.62,28.32 D2.A 105.69,28.32 105.92,28.32 107.22,27.02 117.58,27.02 121.85,31.29 H1.4
N$10
  Top 0.152: T1.1 101.96,52.86 R7.1
N$11
  Top 0.152: T2.1 110.88,41.2 111.56,40.51 114.53,40.51 117.73,43.71 117.73,44.55 119.56,46.38 121.7,46.38 121.85,46.53 121.85,48.89 121.09,49.66 R8.1
N$12
  Top 0.152: T3.1 122.53,54.38 122.53,53.69 121.09,52.25 R9.1
N$13
  Top 0.152: T1.3 99.45,49.27 99.29,49.12 R1.2
N$14
  Top 0.152: T2.3 108.21,39.14 106.46,39.14 101.35,34.03 101.35,29.16 99.06,26.87 R2.2
N$15  (via drill 0.38)
  Top 0.152: v122.92,57.43 123.52,56.82 123.52,56.44 T3.3 | v98.15,31.29 99.06,30.38 R3.2
  Bottom 0.152: v122.92,57.43 108.06,57.43 93.43,42.8 93.43,39.67 92.59,38.84 90.07,38.84 89.39,38.15 89.39,37.69 95.79,31.29 v98.15,31.29
N$16
  Top 0.152: T4.1 107.98,43.03 109.96,43.03 111.03,44.09 112.7,44.09 115.75,47.14 121.01,47.14 R10.1
N$17
  Top 0.152: C1.2 103.79,50.34 103.79,52.86 R7.2 103.87,52.86 111.94,52.86 113.39,54.3 119.03,54.3 120.32,53.01 120.32,51.56 120.48,51.41 122.76,51.41 | 122.76,44.63 122.76,47.14 R10.2 122.76,47.22 122.76,49.66 R8.2 122.76,49.73 122.76,51.41 | 122.76,51.41 122.76,52.25 R9.2 | IC7.7 121.92,43.79 122.76,44.63 | 122.76,44.63 R11.2
N$18  (via drill 0.38)
  Top 0.152: v101.96,47.83 101.96,46.53 C5.1 | v101.96,49.05 101.96,50.34 C1.1 | R11.1 120.32,44.63 v120.02,44.32 | v120.25,37.92 120.25,36.7 120.29,36.66 | 120.29,36.66 120.63,36.32 IC7.1 | v107.45,27.63 108.13,28.32 D2.C 108.21,28.32 108.44,28.32 109.2,27.56 114.76,27.56 118.5,31.29 118.5,35.94 118.88,36.32 C6.1 118.95,36.4 119.18,36.63 120.25,36.63 120.29,36.66
  Bottom 0.152: v101.96,47.83 v101.96,49.05 104.17,49.05 110.57,55.45 110.57,55.6 110.72,55.75 112.25,55.75 120.02,47.98 v120.02,44.32 120.02,38.15 v120.25,37.92 | v107.45,27.63 106.38,27.63 101.66,22.91 101.66,18.87 102.57,17.96 102.57,9.5 F1.P$2
N$19
  Top 0.152: 8.81,28.28 5.8,31.29 H2.4 | 8.81,28.28 8.84,28.24 13.95,28.24 14.79,29.08 15.09,29.08 D1.A | 8.81,28.28 5.11,24.59 5.11,19.86 F2.P$1
N$20  (via drill 0.38)
  Top 0.152: v42.52,23.6 39.25,26.87 39.25,29.23 34.6,33.88 33.3,33.88 28.81,38.38 22.41,38.38 21.04,39.75 13.64,39.75 13.42,39.52 13.42,38.45 12.88,37.92 9.99,37.92 9.61,38.3 9.61,39.37 8.62,40.36 8.62,45.46 R15.1 | v48.54,24.81 52.35,24.81 52.58,25.04 IC2.2
  Bottom 0.152: v42.52,23.6 43.67,23.6 44.81,24.74 48.47,24.74 v48.54,24.81
N$21
  Top 0.152: R13.2 112.25,28.4 112.25,31.22 114.53,33.5 H1.1
N$22
  Top 0.152: T8.3 95.18,58.72 98,61.54 R14.2
N$23
  Top 0.305: H1.3 114.61,29.08 114.61,31.82 115.75,32.97 115.75,34.19 113.39,36.55 110.34,36.55 U$1.P$1
N$24
  Top 0.152: R16.1 17.61,50.34 18.44,49.5 24.69,49.5 27.59,46.61 27.59,42.19 32.16,37.62 32.16,35.48 33.46,34.19 40.7,34.19 44.2,30.68 47.17,30.68 49,28.85 52.58,28.85 IC2.5
N$25  (via drill 0.38)
  Top 0.152: v8.54,48.67 8.54,49.81 R17.1 | v38.87,23.06 v36.28,20.47 | v49,30.15 49.38,30.15 50.07,29.46 50.98,29.46 51.67,30.15 IC2.6
  Bottom 0.152: v8.54,48.67 8.54,43.1 16.84,34.8 17.91,34.8 19.05,33.65 21.72,33.65 31.86,23.52 33.61,23.52 36.28,20.85 v36.28,20.47 | v38.87,23.06 41.15,23.06 43.13,25.04 47.86,25.04 49.31,26.49 49.31,29.84 v49,30.15
N$26  (via drill 0.38)
  Top 0.152: v19.66,56.82 21.04,56.82 23.25,54.61 25.61,54.61 27.21,53.01 27.21,49.12 30.48,45.85 v30.48,40.13 | v30.33,34.19 v30.33,36.02 | v50.07,33.27 51.9,33.27 52.58,33.96 IC2.9
  Bottom 0.152: v19.66,56.82 R18.1 | v30.48,40.13 30.48,36.17 v30.33,36.02 | v30.33,34.19 30.33,29.08 31.55,27.86 41.76,27.86 44.35,30.45 47.25,30.45 v50.07,33.27
N$27  (via drill 0.38)
  Top 0.152: v28.2,42.42 28.2,46.46 24.85,49.81 21.34,49.81 19.05,52.09 19.05,60.25 14.25,65.05 12.96,65.05 R19.1 | v28.2,40.74 28.2,40.44 v31.55,37.08 | v44.35,34.8 44.66,34.8 45.5,33.96 IC2.12
  Bottom 0.152: v28.2,40.74 v28.2,42.42 | v31.55,37.08 31.93,37.08 34.22,34.8 v44.35,34.8
N$28  (via drill 0.38)
  Top 0.152: v25.23,45.31 24.85,45.31 22.03,42.49 20.58,42.49 19.74,43.33 19.74,43.79 19.59,43.94 18.6,43.94 17.76,44.78 16.24,44.78 15.47,44.02 R44.2
  Bottom 0.152: v25.23,45.31 24.54,46 24.54,46.15 T13.3
N$29
  Top 0.152: T6.3 10.9,45.92 9.61,45.92 9.22,46.3 7.7,46.3 6.94,45.54 R15.2
N$30
  Top 0.152: T7.3 13.19,53.85 13.03,53.85 11.28,52.09 11.28,50.34 R16.2
N$31
  Top 0.152: T9.3 8.39,55.98 11.21,55.98 11.59,56.36 12.58,56.36 12.73,56.21 12.73,54.61 11.89,53.77 11.89,53.31 9.22,50.65 7.55,50.65 6.79,49.88 R17.2
N$32  (via drill 0.38)
  Top 0.152: v13.95,56.82 T10.3
  Bottom 0.152: R18.2 v13.95,56.82
N$33
  Top 0.152: T11.3 13.03,62.84 13.03,63.3 11.28,65.05 R19.2
N$34
  Top 0.152: D4.A 61.5,2.64 61.5,3.1 62.64,4.24 62.64,6.53 63.1,6.98 63.1,7.44 62.72,7.82 60.66,7.82 IC6.1
N$35
  Top 0.152: T6.1 11.89,47.9 11.89,45.62 11.05,44.78 10.6,44.78 10.29,44.47 10.29,38.99 10.37,38.91 R22.1
N$36
  Top 0.152: T7.1 12.2,51.87 12.2,51.03 11.97,50.8 11.97,49.66 9.91,47.6 8.39,47.6 R23.1
N$37
  Top 0.152: T9.1 6.41,56.89 6.41,56.06 7.55,54.91 7.55,52.63 6.79,51.87 R24.1
N$38
  Top 0.152: T10.1 9.91,55.68 8.54,54.3 R25.1
N$39  (via drill 0.38)
  Top 0.152: 6.37,50.84 6.56,51.03 7.62,51.03 8.46,51.87 R24.2 | 6.37,50.84 6.02,50.49 6.02,49.2 6.63,48.59 6.63,47.6 R23.2 6.63,47.52 6.63,46.68 5.49,45.54 5.49,43.03 4.5,42.04 4.5,41.58 IC8.7 4.5,41.5 4.5,40.97 6.56,38.91 R22.2 9.22,38.38 v9.22,37.84 | 6.37,50.84 6.02,51.18 6.02,52.55 6.71,53.24 6.71,54.23 R25.2 | R26.2 14.18,38.91 14.18,36.85 13.72,36.4 C2.2 13.64,36.32 v12.43,35.1
  Bottom 0.152: v12.43,35.1 11.97,35.1 v9.22,37.84
N$40  (via drill 0.38)
  Top 0.152: C8.1 30.1,19.4 30.1,23.82 29.87,24.05 C7.1 24.62,24.05 19.59,29.08 17.68,29.08 D1.C 17.61,29.16 17.61,30.53 16.69,31.44 16.69,32.59 16.46,32.82 12.12,32.82 11.82,33.12 11.82,34.95 | 11.82,34.95 11.82,36.32 C2.1 11.74,36.4 10.82,37.31 v10.6,37.31 | R26.1 11.82,38.91 v11.43,38.53 | 3.62,35.37 4.04,34.95 11.82,34.95 | 3.62,35.37 3.2,35.79 3.2,36.24 IC8.1 | 3.62,35.37 2.37,34.11 2.37,20.85 5.03,18.19 5.03,9.73 F2.P$2
  Bottom 0.152: v11.43,38.53 11.43,38.15 v10.6,37.31
N$41
  Bottom 0.152: T12.1 23.55,52.02 23.55,52.7 24.31,53.47 R37.1
N$42
  Top 0.152: R21.2 15.85,31.9 13.03,29.08 H2.1
N$43
  Top 0.152: T15.1 11.89,42.65 11.89,43.33 11.28,43.94 R38.1
N$44  (via drill 0.38)
  Top 0.152: v21.95,43.25 21.95,44.17 20.88,45.24 20.05,45.24 T14.1
  Bottom 0.152: v21.95,43.25 21.95,43.48 22.71,44.25 R39.1
N$45
  Top 0.152: T5.1 113.09,39.22 114.3,39.22 115.14,40.05 120.25,40.05 122.61,37.69 123.6,37.69 124.44,36.85 124.44,36.32 IC7.4
N$46
  Bottom 0.152: T13.1 23.55,48.13 23.55,42.49 22.79,41.73 R40.1
N$47
  Top 0.152: T11.1 12.04,60.7 8.92,60.7 2.6,54.38 2.6,40.36 5.26,37.69 6.1,37.69 6.94,36.85 6.94,36.32 IC8.4
N$48
  Top 0.152: T14.3 19.05,43.18 19.05,41.58 18.98,41.5 R43.2
N$49  (via drill 0.38)
  Top 0.152: v24.46,48.89 26.83,46.53 26.83,42.04 24.39,39.6 R41.2
  Bottom 0.152: v24.46,48.89 24.46,49.96 T12.3
N$50
  Top 0.152: T15.3 10.98,40.59 11.74,40.59 12.58,41.43 15.09,41.43 R42.2
N$51
  Top 0.305: H2.3 13.11,33.5 19.89,33.5 20.88,32.51 U$2.P$1
N$52
  Top 0.152: R31.1 68.13,7.06 68.13,5.54 R32.2 68.05,5.46 66.07,5.46 65.92,5.31 IC6.6
N$54
  Top 0.152: 58.22,6.53 58.22,7.06 R29.1 | 58.22,6.53 58.22,5.54 R30.2 | IC6.2 58.22,6.53
N$55
  Top 0.152: IC6.7 65.38,6.53 64.47,5.61 64.47,2.95 64.85,2.56 66.22,2.56 D5.A
RADC
  Top 0.152: D5.C 63.78,2.64 63.78,6.22 64.77,7.21 67.06,7.21 67.29,7.44 67.29,7.97 68.05,8.74 R31.2 68.05,8.81 66.37,10.49 C14.1 66.3,10.49 66.45,10.64 66.45,14.38 69.65,17.58 69.65,24.36 68.43,25.58 68.43,28.85 66.6,30.68 IC5.27
RCLOCK  (via drill 0.38)
  Top 0.152: v47.55,28.93 45.95,28.93 IC2.16 | v43.67,28.93 40.09,28.93 v39.86,28.7 | v37.88,28.47 37.88,24.89 41.46,21.31 41.46,19.1 40.92,18.57 37.19,18.57 34.07,15.44 32.77,15.44 32.39,15.06 32.39,14.6 33.15,13.84 42.45,13.84 44.96,11.33 44.96,7.06 47.71,4.32 49.15,4.32 50.68,5.84 X4.3
  Bottom 0.152: v43.67,28.93 v47.55,28.93 | v39.86,28.7 38.1,28.7 v37.88,28.47
RCLR
  Top 0.152: IC2.19 45.95,25.04 46.94,25.04 51.44,20.55 51.44,8.96 X4.4
RDIN
  Top 0.152: IC2.15 45.5,30.15 44.28,28.93 44.28,28.7 42.75,27.18 41.91,27.18 41.23,26.49 41.23,25.42 42.45,24.2 42.75,24.2 51.06,15.9 51.06,11.4 49.92,10.26 49.92,8.96 X4.2
RHVTRIG  (via drill 0.38)
  Top 0.152: v72.01,25.73 72.01,25.5 72.62,24.89 73,24.89 IC5.3 | v64.09,21.92 56.24,21.92 53.8,24.36 48.92,24.36 48.77,24.2 48.32,24.2 47.32,25.2 47.32,25.42 47.1,25.65 44.81,25.65 44.51,25.35 42.22,25.35 41.84,25.73 41.84,26.19 42.22,26.57 42.98,26.57 v43.29,26.26 | v33.84,25.27 33.84,23.21 v33.23,22.6 | v18.52,31.06 17.68,31.9 R21.1
  Bottom 0.152: v72.01,25.73 67.9,25.73 v64.09,21.92 | v43.29,26.26 42.98,26.26 42.07,27.18 35.74,27.18 v33.84,25.27 | v33.23,22.6 26.98,22.6 v18.52,31.06
ROPA  (via drill 0.38)
  Top 0.152: U$2.P$4 20.96,37.31 26.06,32.21 30.48,32.21 R28.1 34.45,28.17 34.45,23.37 33.99,22.91 v33.99,21.84 | v65.08,3.17 65.84,3.94 IC6.5
  Bottom 0.152: v65.08,3.17 48.01,3.17 38.41,12.77 37.8,12.77 33.99,16.58 v33.99,21.84
RTS+
  Top 0.152: F2.P$4 28.05,13.61 28.05,13.92 R27.2 28.05,13.54 35.29,13.54 37.19,11.63 42.3,11.63 X3.1
RTS-  (via drill 0.38)
  Top 0.152: R27.1 28.05,15.67 28.05,15.98 24.16,19.86 F2.P$3 | X3.2 42.3,2.72 42.3,4.16 34.9,11.56 X3.3 34.83,11.63 v32.39,11.63
  Bottom 0.152: v32.39,11.63 24.16,19.86 F2.P$3
RVSEL
  Top 0.152: IC5.25 65.31,32.05 60.05,32.05 57.46,34.64 46.49,34.64 45.95,35.18 IC2.11
SPKR  (via drill 0.38)
  Top 0.152: v94.26,45.62 94.26,40.51 91.06,37.31 70.87,37.31 69.04,35.48 69.04,33.35 71.63,30.76 73,30.76 IC5.12 | v96.85,61.85 96.85,62.38 R14.1
  Bottom 0.152: v94.26,45.62 94.26,47.52 96.85,50.11 v96.85,61.85
TCK  (via drill 0.38)
  Top 0.152: 66.45,20.62 66.45,14.83 65.46,13.84 65.46,13.69 SV1.3 | 66.45,20.62 66.45,24.81 65.84,25.42 65.38,25.42 IC5.35 | 66.45,20.62 v67.75,20.62
  Bottom 0.152: v67.75,20.62 90.45,20.62 106.91,37.08 106.91,37.54 S5.4
TDI
  Top 0.152: IC5.37 65.38,24.13 65.84,24.13 66.15,23.82 66.15,18.19 63.4,15.44 62.11,15.44 60.35,13.69 SV1.5
  Bottom 0.152: S7.4 50.53,16.97 51.44,16.05 56.77,16.05 56.85,16.13 57.84,16.13 SV1.5
TDO
  Top 0.152: SV1.6 59.9,15.75 63.25,15.75 65.69,18.19 65.69,18.64 65.38,18.95 65.38,23.52 IC5.38
TEST
  Top 0.152: IC5.1 73,23.52 73,16.2 70.49,13.69 SV1.1
TMS  (via drill 0.38)
  Top 0.152: v64.32,24.81 65.31,24.81 IC5.36 | v48.7,27.33 49.69,27.33 v50.98,26.03
  Bottom 0.152: SV1.4 62.87,13.69 58.75,17.8 58.75,20.55 63.02,24.81 v64.32,24.81 64.93,25.42 64.93,26.34 64.55,26.72 53.95,26.72 53.27,26.03 v50.98,26.03 | v48.7,27.33 48.54,27.48 31.02,27.48 23.4,35.1 19.51,35.1 16.46,38.15 16.16,38.15 S6.4
VBAT  (via drill 0.38)
  Top 0.152: v66.37,30.07 65.38,30.07 IC5.28 | v68.74,32.43 68.74,35.63 71.02,37.92 v90,37.92 | v99.29,40.89 101.12,42.72 R46.2 R45.1
  Bottom 0.152: v68.74,32.43 v66.37,30.07 | v90,37.92 90.61,38.53 96.93,38.53 v99.29,40.89
VCC  (via drill 0.38)
  Top 0.305: v50.45,13.84 50.45,13.54 49.15,12.24 49.15,8.96 X4.1 | v57.08,15.52 59.06,15.52 61.96,18.41 v65.08,18.41 | v74.07,12.39 74.07,9.19 X2.1 | L3.1 107.9,61.77 105.62,61.77 104.17,63.22 104.17,65.35 104.4,65.58 106.15,65.58 107.37,64.36 108.06,64.36 C10.1 108.21,64.21 115.07,64.21 118.72,60.55 SG1.+ 118.88,60.48 122.38,56.97 122.38,56.29 123.6,55.07 123.6,43.94 122.53,42.87 122.53,40.28 122.31,40.05 121.54,40.05 121.31,40.28 121.31,42.72 120.4,43.64 IC3.3 118.5,43.48 118.11,43.1 v118.11,42.34 | v88.02,19.4 97.24,19.4 v97.69,19.86
  Bottom 0.305: v50.45,13.84 50.6,13.84 52.28,15.52 v57.08,15.52 | v65.08,18.41 68.05,18.41 v74.07,12.39 74.15,12.47 76.28,12.47 83.21,19.4 v88.02,19.4 | v97.69,19.86 97.69,21.39 106,29.69 106,32.59 109.5,36.09 115.52,36.09 118.11,38.68 v118.11,42.34
XIN
  Top 0.152: IC5.6 73.08,26.8 76.59,26.8 Q3.2 78.11,28.4 79.02,29.31 79.02,31.29 C12.1
XOUT
  Top 0.152: 78.11,26.57 77.73,26.19 73.08,26.19 IC5.5 | 78.11,26.57 80.62,26.57 C11.1 | 78.11,26.57 Q3.1

## Text on the board
tDocu: eTapper Main R52
DrillLegend: LAYER-STACK
DrillLegend_01-16: 01-16
DrillLegend_01-20: 01-20